# EAGLE design tricoreVCO (EAGLE 9.6.0)
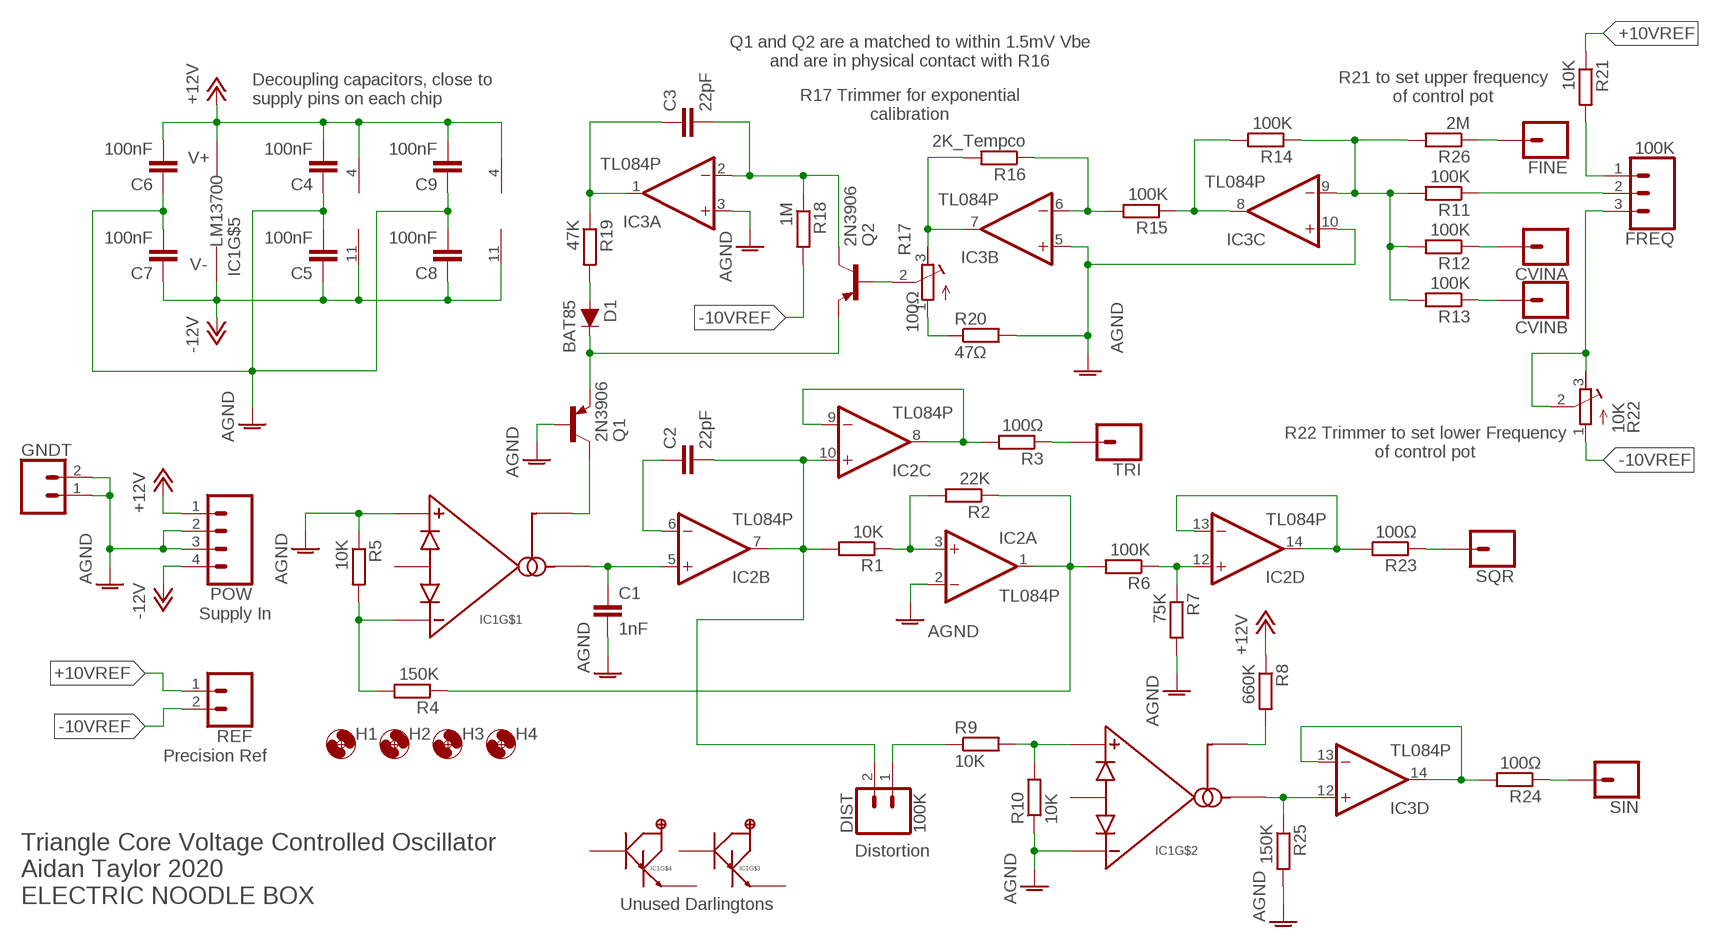
[diagram p0: schematic, sheet 1]

## Parts
C1  1nF  C-EU050-025X075  [C050-025X075]
C2  22pF  C-EU050-025X075  [C050-025X075]
C3  22pF  C-EU050-025X075  [C050-025X075]
C4  100nF  C-EU050-025X075  [C050-025X075]
C5  100nF  C-EU050-025X075  [C050-025X075]
C6  100nF  C-EU050-025X075  [C050-025X075]
C7  100nF  C-EU050-025X075  [C050-025X075]
C8  100nF  C-EU050-025X075  [C050-025X075]
C9  100nF  C-EU050-025X075  [C050-025X075]
CVINA  CONN_01  [1X01]
CVINB  CONN_01  [1X01]
D1  BAT85  DIODE-1N4148  [DIODE-1N4148]
DIST  100K  CONN_02  [1X02]
FINE  CONN_01  [1X01]
FREQ  100K  CONN_03  [1X03]
GNDT  CONN_02  [1X02]
H1  MOUNT-HOLE3.2  [3,2]
H2  MOUNT-HOLE3.2  [3,2]
H3  MOUNT-HOLE3.2  [3,2]
H4  MOUNT-HOLE3.2  [3,2]
IC1  LM13700_DIP  [DIP16]
IC2  TL084P  [DIL14]
IC3  TL084P  [DIL14]
POW  CONN_04POLAR  [MOLEX-1X4]
Q1  2N3906  [TO92]
Q2  2N3906  [TO92]
R1  10K  R-EU_0207/10  [0207/10]
R2  22K  R-EU_0207/10  [0207/10]
R3  100Ω  R-EU_0207/10  [0207/10]
R4  150K  R-EU_0207/10  [0207/10]
R5  10K  R-EU_0207/10  [0207/10]
R6  100K  R-EU_0207/10  [0207/10]
R7  75K  R-EU_0207/10  [0207/10]
R8  660K  R-EU_0207/10  [0207/10]
R9  10K  R-EU_0207/10  [0207/10]
R10  10K  R-EU_0207/10  [0207/10]
R11  100K  R-EU_0207/10  [0207/10]
R12  100K  R-EU_0207/10  [0207/10]
R13  100K  R-EU_0207/10  [0207/10]
R14  100K  R-EU_0207/10  [0207/10]
R15  100K  R-EU_0207/10  [0207/10]
R16  2K_Tempco  R-EU_0207/10  [0207/10]
R17  100Ω  R-TRIMM3296W  [RTRIM3296W]
R18  1M  R-EU_0207/10  [0207/10]
R19  47K  R-EU_0207/10  [0207/10]
R20  47Ω  R-EU_0207/10  [0207/10]
R21  10K  R-EU_0207/10  [0207/10]
R22  10K  R-TRIMM3296W  [RTRIM3296W]
R23  100Ω  R-EU_0207/10  [0207/10]
R24  100Ω  R-EU_0207/10  [0207/10]
R25  150K  R-EU_0207/10  [0207/10]
R26  2M  R-EU_0207/10  [0207/10]
REF  CONN_02POLAR  [MOLEX-1X2]
SIN  CONN_01  [1X01]
SQR  CONN_01  [1X01]
TRI  CONN_01  [1X01]

## Nets
+10VREF: R21.1 REF.1
+12V: C4.2 C6.2 C9.2 IC1.11(V+) IC2.4(P:V+) IC3.4(P:V+) POW.1 R8.1
-10VREF: R18.2 R22.1(A) REF.2
-12V: C5.1 C7.1 C8.1 IC1.6(V-) IC2.11(P:V-) IC3.11(P:V-) POW.4
AGND: C1.2 C4.1 C5.2 C6.1 C7.2 C8.2 C9.1 GNDT.1 GNDT.2 IC1.3(AMP+) IC1.13(AMP-) IC2.2(A:-IN) IC3.3(A:+IN) IC3.5(B:+IN) IC3.10(C:+IN) POW.2 POW.3 Q1.2(B) R5.1 R7.2 R10.1 R20.2 R25.2
N$1: C2.1 IC2.6(B:-IN)
N$2: C2.2 DIST.2 IC2.7(B:OUT) IC2.10(C:+IN) R1.2
N$3: IC2.3(A:+IN) R1.1 R2.2
N$4: C1.1 IC1.5(AMPOUT) IC2.5(B:+IN)
N$5: IC2.1(A:OUT) R2.1 R4.1 R6.2
N$6: IC2.8(C:OUT) IC2.9(C:-IN) R3.2
N$7: IC1.4(AMP-) R4.2 R5.2
N$8: IC1.14(AMP+) R9.2 R10.2
N$9: IC2.12(D:+IN) R6.1 R7.1
N$10: IC1.12(AMPOUT) IC3.12(D:+IN) R25.1
N$11: IC1.16(AMPBIAS) R8.2
N$12: IC1.1(AMPBIAS) Q1.1(C)
N$13: DIST.1 R9.1
N$14: IC3.7(B:OUT) R16.2 R17.3(E)
N$15: IC3.6(B:-IN) R15.2 R16.1
N$16: IC3.8(C:OUT) R14.2 R15.1
N$17: Q2.2(B) R17.2(S)
N$18: C3.2 IC3.2(A:-IN) Q2.1(C) R18.1
N$19: R17.1(A) R20.1
N$20: C3.1 IC3.1(A:OUT) R19.1
N$21: D1.C Q1.3(E) Q2.3(E)
N$22: D1.A R19.2
N$23: IC3.9(C:-IN) R11.2 R12.2 R13.2 R14.1 R26.2
N$24: FREQ.2 R11.1
N$25: FREQ.3 R22.2(S) R22.3(E)
N$26: FREQ.1 R21.2
N$27: CVINA.1 R12.1
N$28: CVINB.1 R13.1
N$29: R3.1 TRI.1
N$30: R23.1 SQR.1
N$31: R24.1 SIN.1
N$32: FINE.1 R26.1
SINE_OUT: IC3.13(D:-IN) IC3.14(D:OUT) R24.2
SQUARE_OUT: IC2.13(D:-IN) IC2.14(D:OUT) R23.2
Unconnected: IC1.2(DIODES) IC1.7(BUFF_IN) IC1.8(BUFF_OUT) IC1.9(BUFF_OUT) IC1.10(BUFF_IN) IC1.15(DIODES)

## Notes on the sheet
- Q1 and Q2 are a matched to within 1.5mV Vbe
  and are in physical contact with R16
- R21 to set upper frequency
  of control pot
- Decoupling capacitors, close to 
  supply pins on each chip
- R17 Trimmer for exponential
  calibration
- R22 Trimmer to set lower Frequency
  of control pot
- Supply In
- Precision Ref
- Distortion
- Triangle Core Voltage Controlled Oscillator
  Aidan Taylor 2020
  ELECTRIC NOODLE BOX
- Unused Darlingtons

## Library data of the parts
C1-C9 = rcl:C-EU: CAPACITOR, European symbol; SPICEPREFIX: C
CVINA CVINB FINE SIN SQR TRI = SparkFun-Connectors:CONN_01: Single connection point. Often used as Generic Header-pin footprint for 0.1 inch spaced/style header connections On any of the 0.1 inch spaced packages, you can populate with these: Break Away Headers - Straight <https://www.sparkfun.com/products/116> (PRT-00116) Break Away Male Headers - Right Angle <https://www.sparkfun.com/products/553> (PRT-00553) Female Headers <https://www.sparkfun.com/products/115> (PRT-00115) Break Away Headers - Machine Pin <https://www.sparkfun.com/products/117> (PRT-00117) Break Away Female Headers - Swiss Machine Pin <https://www.sparkfun.com/products/743> (PRT-00743) This device is also useful as a general connection point to wire up your design to another part of your project. Our various solder wires solder well into these plated through hole pads. Hook-Up Wire - Assortment (Stranded, 22 AWG) <https://www.sparkfun.com/products/11375> (PRT-11375) Hook-Up Wire - Assortment (Solid Core, 22 AWG) <https://www.sparkfun.com/products/11367> (PRT-11367) View the entire wire category on our website here <https://www.sparkfun.com/categories/141> Special notes: SMTSO-256-ET is a "flush mount" nut for a 4-40 screw. We mostly use this on specialty testbeds; it is a nice way to connect hardware to your PCB at an adjustable hieght. Also note, the SNAP packages are for using a snappable style connector. We sell a baggie of snaps and they are also used on two LilyPad designs: Snap Assortment - 30 pack (male and female) <https://www.sparkfun.com/products/11347> (DEV-11347) LilyPad Arduino SimpleSnap <https://www.sparkfun.com/products/10941> (DEV-10941) LilyPad SimpleSnap Protoboard <https://www.sparkfun.com/products/10940> (DEV-10940)
D1 = SparkFun-DiscreteSemi:DIODE: Diode These are standard reverse protection diodes and small signal diodes. SparkFun Products: SparkFun SparkPunk Sound Kit <https://www.sparkfun.com/products/11177> SparkFun ESP8266 Thing <https://www.sparkfun.com/products/13231>; PROD_ID: DIO-08378; VALUE: 200mA/100V/1V
DIST GNDT = SparkFun-Connectors:CONN_02: Multi connection point. Often used as Generic Header-pin footprint for 0.1 inch spaced/style header connections On any of the 0.1 inch spaced packages, you can populate with these: Break Away Headers - Straight <https://www.sparkfun.com/products/116> (PRT-00116) Break Away Male Headers - Right Angle <https://www.sparkfun.com/products/553> (PRT-00553) Female Headers <https://www.sparkfun.com/products/115> (PRT-00115) Break Away Headers - Machine Pin <https://www.sparkfun.com/products/117> (PRT-00117) Break Away Female Headers - Swiss Machine Pin <https://www.sparkfun.com/products/743> (PRT-00743) For SCREWTERMINALS and SPRING TERMINALS visit here: Screw Terimnals on SparkFun.com <https://www.sparkfun.com/search/results?term=Screw+Terminals> (5mm/3.5mm/2.54mm spacing) This device is also useful as a general connection point to wire up your design to another part of your project. Our various solder wires solder well into these plated through hole pads. Hook-Up Wire - Assortment (Stranded, 22 AWG) <https://www.sparkfun.com/products/11375> (PRT-11375) Hook-Up Wire - Assortment (Solid Core, 22 AWG) <https://www.sparkfun.com/products/11367> (PRT-11367) View the entire wire category on our website here <https://www.sparkfun.com/categories/141> Special notes: Molex polarized connector foot print use with: PRT-08233 with associated crimp pins and housings. 2.54_SCREWTERM for use with PRT-10571. 3.5mm Screw Terminal footprints for PRT-08084 5mm Screw Terminal footprints for use with PRT-08432
FREQ = SparkFun-Connectors:CONN_03: Multi connection point. Often used as Generic Header-pin footprint for 0.1 inch spaced/style header connections On any of the 0.1 inch spaced packages, you can populate with these: Break Away Headers - Straight <https://www.sparkfun.com/products/116> (PRT-00116) Break Away Male Headers - Right Angle <https://www.sparkfun.com/products/553> (PRT-00553) Female Headers <https://www.sparkfun.com/products/115> (PRT-00115) Break Away Headers - Machine Pin <https://www.sparkfun.com/products/117> (PRT-00117) Break Away Female Headers - Swiss Machine Pin <https://www.sparkfun.com/products/743> (PRT-00743) Stackable Header - 3 Pin (Female, 0.1") <https://www.sparkfun.com/products/13875> (PRT-13875) For SCREWTERMINALS and SPRING TERMINALS visit here: Screw Terimnals on SparkFun.com <https://www.sparkfun.com/search/results?term=Screw+Terminals> (5mm/3.5mm/2.54mm spacing) This device is also useful as a general connection point to wire up your design to another part of your project. Our various solder wires solder well into these plated through hole pads. Hook-Up Wire - Assortment (Stranded, 22 AWG) <https://www.sparkfun.com/products/11375> (PRT-11375) Hook-Up Wire - Assortment (Solid Core, 22 AWG) <https://www.sparkfun.com/products/11367> (PRT-11367) View the entire wire category on our website here <https://www.sparkfun.com/categories/141> Special notes: Molex polarized connector foot print use with SKU : PRT-08232 with associated crimp pins and housings.; PROD_ID: XXX-00000; VALUE: 455-1750-1-ND
H1-H4 = holes:MOUNT-HOLE: MOUNTING HOLE with drill center marker
IC1 = ElectricNoodleBox2018:LM13700_DIP
IC2 IC3 = linear:TL084: OP AMP
POW = SparkFun-Connectors:CONN_04: Multi connection point. Often used as Generic Header-pin footprint for 0.1 inch spaced/style header connections On any of the 0.1 inch spaced packages, you can populate with these: Break Away Headers - Straight <https://www.sparkfun.com/products/116> (PRT-00116) Break Away Male Headers - Right Angle <https://www.sparkfun.com/products/553> (PRT-00553) Female Headers <https://www.sparkfun.com/products/115> (PRT-00115) Break Away Headers - Machine Pin <https://www.sparkfun.com/products/117> (PRT-00117) Break Away Female Headers - Swiss Machine Pin <https://www.sparkfun.com/products/743> (PRT-00743) For SCREWTERMINALS and SPRING TERMINALS visit here: Screw Terimnals on SparkFun.com <https://www.sparkfun.com/search/results?term=Screw+Terminals> (5mm/3.5mm/2.54mm spacing) This device is also useful as a general connection point to wire up your design to another part of your project. Our various solder wires solder well into these plated through hole pads. Hook-Up Wire - Assortment (Stranded, 22 AWG) <https://www.sparkfun.com/products/11375> (PRT-11375) Hook-Up Wire - Assortment (Solid Core, 22 AWG) <https://www.sparkfun.com/products/11367> (PRT-11367) View the entire wire category on our website here <https://www.sparkfun.com/categories/141> Special notes: Molex polarized connector foot print use with SKU : PRT-08231 with associated crimp pins and housings. 1MM SMD Version SKU: PRT-10208; PROD_ID: CONN-08186; SF_ID: PRT-08231
Q1 Q2 = transistor-pnp:2N3906: PNP Transistor
R1-R16 R18-R21 R23-R26 = rcl:R-EU_: RESISTOR, European symbol; SPICEPREFIX: R
R17 R22 = rcl:R-TRIMM: Trimm resistor; SPICEMODEL: X; SPICEPREFIXL: POT
REF = SparkFun-Connectors:CONN_02: Multi connection point. Often used as Generic Header-pin footprint for 0.1 inch spaced/style header connections On any of the 0.1 inch spaced packages, you can populate with these: Break Away Headers - Straight <https://www.sparkfun.com/products/116> (PRT-00116) Break Away Male Headers - Right Angle <https://www.sparkfun.com/products/553> (PRT-00553) Female Headers <https://www.sparkfun.com/products/115> (PRT-00115) Break Away Headers - Machine Pin <https://www.sparkfun.com/products/117> (PRT-00117) Break Away Female Headers - Swiss Machine Pin <https://www.sparkfun.com/products/743> (PRT-00743) For SCREWTERMINALS and SPRING TERMINALS visit here: Screw Terimnals on SparkFun.com <https://www.sparkfun.com/search/results?term=Screw+Terminals> (5mm/3.5mm/2.54mm spacing) This device is also useful as a general connection point to wire up your design to another part of your project. Our various solder wires solder well into these plated through hole pads. Hook-Up Wire - Assortment (Stranded, 22 AWG) <https://www.sparkfun.com/products/11375> (PRT-11375) Hook-Up Wire - Assortment (Solid Core, 22 AWG) <https://www.sparkfun.com/products/11367> (PRT-11367) View the entire wire category on our website here <https://www.sparkfun.com/categories/141> Special notes: Molex polarized connector foot print use with: PRT-08233 with associated crimp pins and housings. 2.54_SCREWTERM for use with PRT-10571. 3.5mm Screw Terminal footprints for PRT-08084 5mm Screw Terminal footprints for use with PRT-08432; SF_ID: PRT-09918

## Board
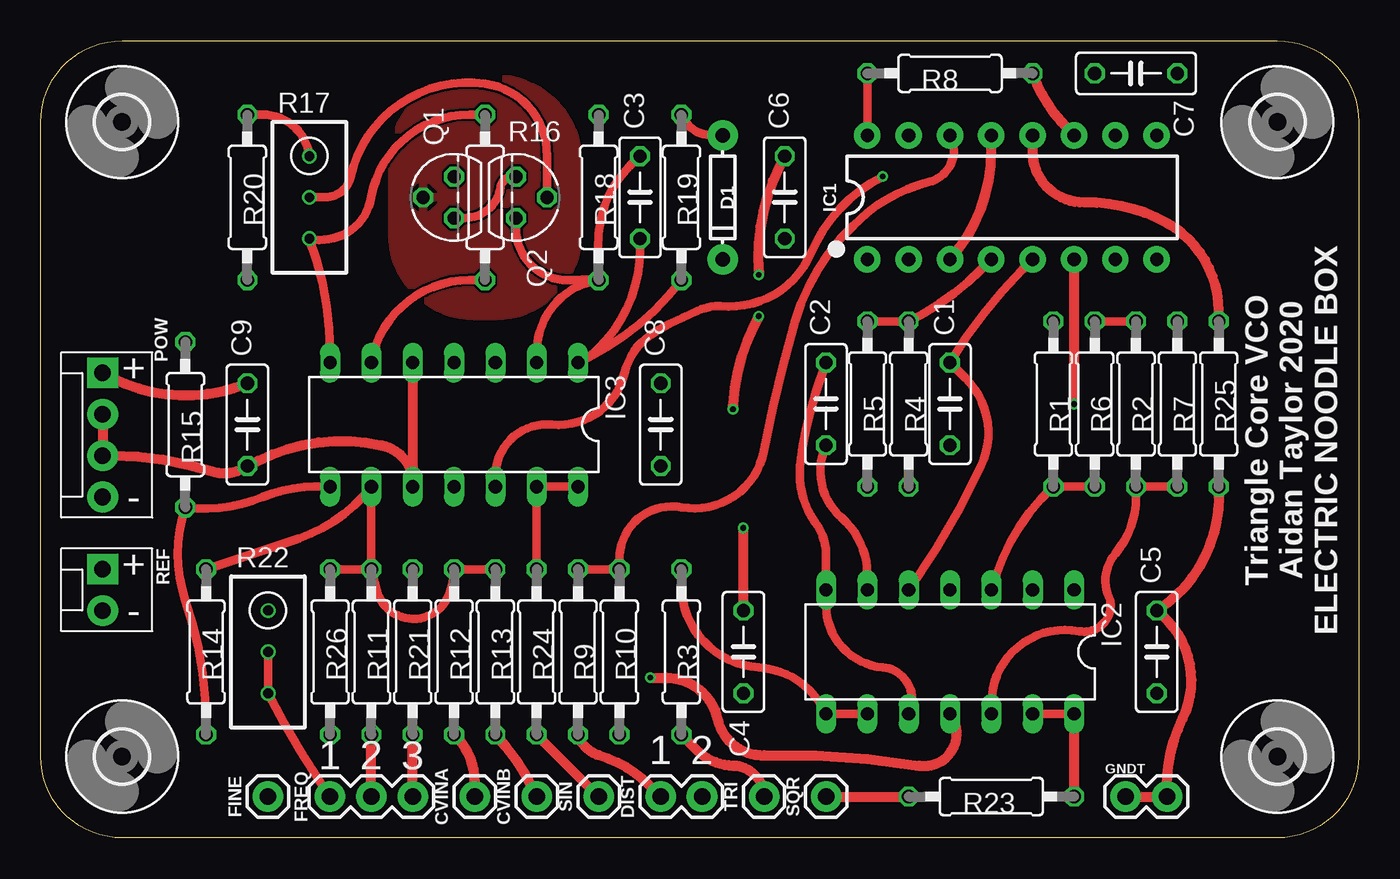
[diagram p1: board, top side]
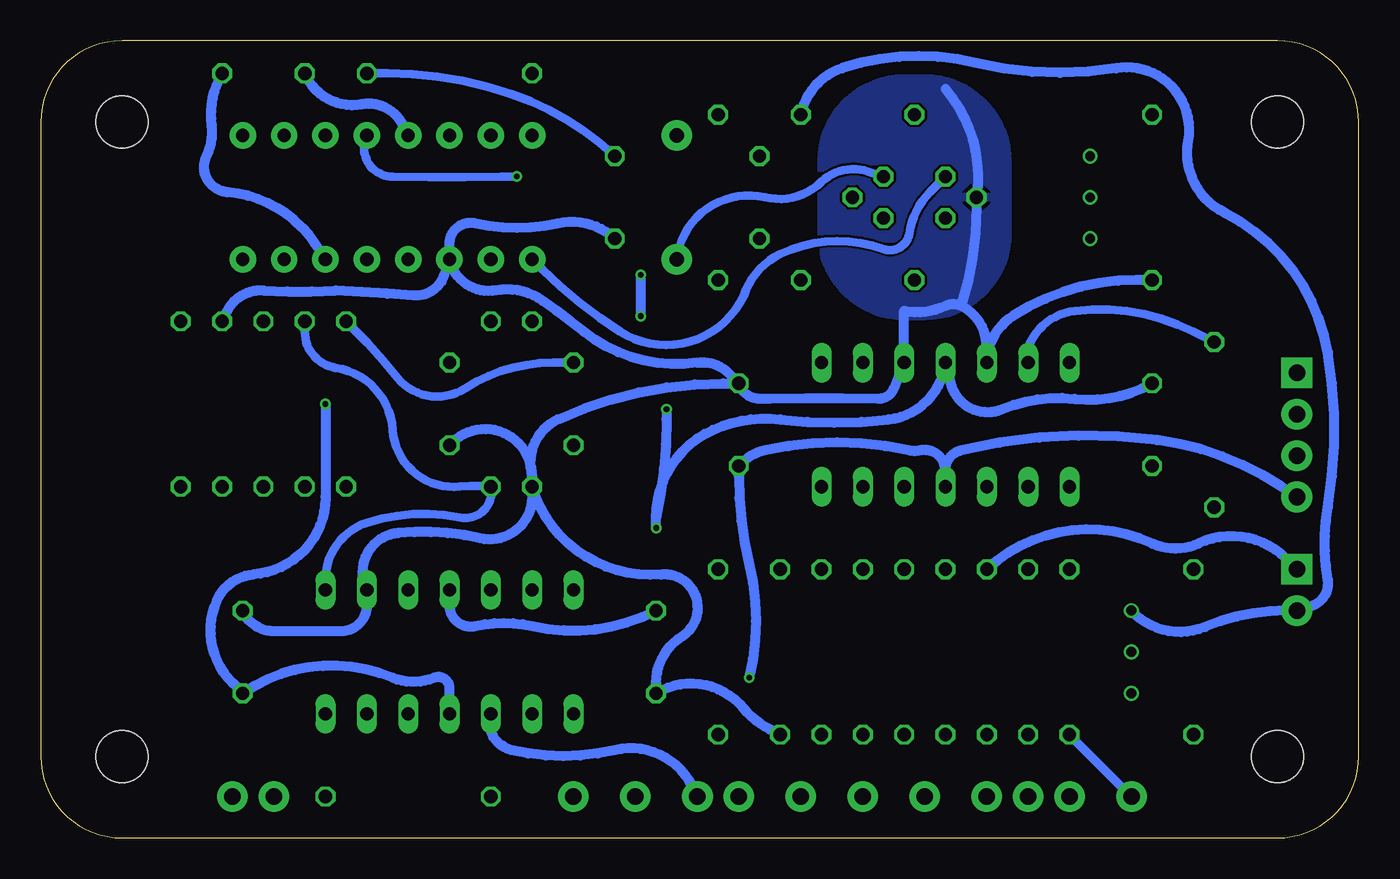
[diagram p2: board, bottom side, seen from below]

Size 81 x 49 mm. Coordinates in mm from the lower left corner, seen from the top.
Outline: 5,49 76,49 arc-90 81,44 81,5 arc-90 76,0 5,0 arc-90 0,5 0,44 arc-90 5,49
Copper layers (1*16): Top 0.035mm / dielectric 1.6mm / Bottom 0.035mm
Design rules "Elecrow_2-layer_PCB_eagle_rule": minimum track width 6mil, minimum drill 12mil, track to track 6mil, track to pad 6mil, pad to pad 6mil, via to via 8mil, smd to smd 0mil, copper to edge 20mil, drill to drill 10mil, minimum pad ring 6mil, minimum via ring 6mil, stop-mask expansion 0mil, vias tented up to drill 100mil, thermal gap 10mil

### Footprints (pad centres in the part's own frame; a part is rotated, then mirrored left to right if it is on the bottom)
C050-025X075 = drill 0.813 octagon: 1 -2.54,0; 2 2.54,0
1X01 = drill 1.016 pad 1.88: 1 0,0
DIODE-1N4148 = drill 0.9 pad 1.88: A -3.81,0; C 3.81,0
1X02 = drill 1.016 pad 1.88: 1 0,0; 2 2.54,0
1X03 = drill 1.016 pad 1.88: 1 0,0; 2 2.54,0; 3 5.08,0
3,2 = hole 3.2: 0,0
DIP16 = drill 0.813 pad 1.626: 1 -8.89,-3.81; 2 -6.35,-3.81; 3 -3.81,-3.81; 4 -1.27,-3.81; 5 1.27,-3.81; 6 3.81,-3.81; 7 6.35,-3.81; 8 8.89,-3.81; 9 8.89,3.81; 10 6.35,3.81; 11 3.81,3.81; 12 1.27,3.81; 13 -1.27,3.81; 14 -3.81,3.81; 15 -6.35,3.81; 16 -8.89,3.81
DIL14 = drill 0.813 long: 1 -7.62,-3.81; 2 -5.08,-3.81; 3 -2.54,-3.81; 4 0,-3.81; 5 2.54,-3.81; 6 5.08,-3.81; 7 7.62,-3.81; 8 7.62,3.81; 9 5.08,3.81; 10 2.54,3.81; 11 0,3.81; 12 -2.54,3.81; 13 -5.08,3.81; 14 -7.62,3.81
MOLEX-1X4 = drill 1.016 pad 1.88 square: 1 0,0 | drill 1.016 pad 1.88: 2 2.54,0; 3 5.08,0; 4 7.62,0
TO92 = drill 0.813 octagon: 1 1.27,0; 2 0,1.905; 3 -1.27,0
0207/10 = drill 0.813 octagon: 1 -5.08,0; 2 5.08,0
RTRIM3296W = drill 0.61: 1 0,-2.54; 2 0,0; 3 0,2.54
MOLEX-1X2 = drill 1.016 pad 1.88 square: 1 0,0 | drill 1.016 pad 1.88: 2 2.54,0

### Placement (x,y rotation side)
C1  55.88,26.67 270 top
C2  48.26,26.67 90 top
C3  36.83,39.37 90 top
C4  43.18,11.43 90 top
C5  68.58,11.43 90 top
C6  45.72,39.37 90 top
C7  67.31,46.99 180 top
C8  38.1,25.4 90 top
C9  12.7,25.4 90 top
CVINA  26.67,2.54 0 top
CVINB  30.48,2.54 0 top
D1  41.91,39.37 270 top
DIST  38.1,2.54 0 top
FINE  13.97,2.54 0 top
FREQ  22.86,2.54 180 top
GNDT  66.67,2.54 0 top
H1  76,44 0 top
H2  76,5 0 top
H3  5,5 0 top
H4  5,44 0 top
IC1  59.69,39.37 0 top
IC2  55.88,11.43 180 top
IC3  25.4,25.4 180 top
POW  3.81,28.57 270 top
Q1  25.4,39.37 90 top
Q2  29.21,39.37 270 top
R1  62.23,26.67 90 top
R2  64.77,26.67 270 top
R3  39.37,11.43 90 top
R4  53.34,26.67 90 top
R5  50.8,26.67 90 top
R6  67.31,26.67 90 top
R7  69.85,26.67 90 top
R8  55.88,46.99 180 top
R9  33.02,11.43 90 top
R10  35.56,11.43 90 top
R11  20.32,11.43 90 top
R12  25.4,11.43 90 top
R13  27.94,11.43 90 top
R14  10.16,11.43 270 top
R15  8.89,25.4 90 top
R16  27.3,39.37 90 top
R17  16.51,39.37 180 top
R18  34.29,39.37 90 top
R19  39.37,39.37 90 top
R20  12.7,39.37 270 top
R21  22.86,11.43 270 top
R22  13.97,11.43 180 top
R23  58.42,2.54 0 top
R24  30.48,11.43 90 top
R25  72.39,26.67 270 top
R26  17.78,11.43 90 top
REF  3.81,16.51 270 top
SIN  34.29,2.54 0 top
SQR  48.26,2.54 0 top
TRI  44.45,2.54 0 top

### Tracks (layer width: path | path; a pad name or v marks a point on that pad's centre or on a via)
+10VREF
  Bottom 0.61: REF.1 4.45,17.14 arc-70 9.84,18.1 arc50 12.7,18.1 arc-68 R21.1
+12V  (via drill 0.35)
  Top 0.61: C4.2 v43.18,19.05 | C6.2 45.4,41.27 arc32 v44.13,34.61 | v44.13,32.07 43.81,31.43 arc23 42.55,26.67 arc7 v42.55,26.35 | IC1.11 63.18,43.5 arc-25 R8.1 | POW.1 4.45,28.26 arc49 C9.2
  Bottom 0.508: R8.1 59.69,46.99 arc19 52.07,45.72 arc24 C6.2
  Bottom 0.61: IC2.4 55.88,14.29 arc-103 54.29,13.02 arc25 50.8,13.02 arc-40 C4.2 | v43.18,19.05 43.18,19.68 | 43.18,19.68 arc66 39.69,25.08 arc31 35.56,25.72 arc-13 28.89,25.72 arc-77 IC3.4 25.08,27.94 arc-99 21.91,26.35 arc29 17.46,26.99 arc-36 C9.2 | v44.13,34.61 v44.13,32.07 | v42.55,26.35 42.55,25.72 arc12 43.18,19.68
-10VREF
  Bottom 0.61: R22.1 arc-70 9.46,12.97 arc23 4.45,13.97 REF.2 2.86,14.29 arc-81 1.91,15.88 arc19 1.91,20.32 arc-19 1.91,29.84 arc-54 8.26,38.42 arc74 10.48,42.86 arc-66 12.06,46.67 arc-44 14.92,47.31 arc23 23.5,47.62 arc-32 31.75,47.31 arc-61 R18.2
-12V  (via drill 0.35)
  Top 0.61: v37.47,9.84 38.42,9.84 arc-77 41.59,7.3 arc79 44.45,5.08 arc-11 53.98,4.45 arc136 IC2.11 | IC1.6 v63.5,26.67
  Bottom 0.61: IC2.11 55.88,9.21 arc-113 56.83,9.84 arc45 59.37,9.84 arc-57 C5.1 69.22,9.53 arc69 70.17,14.61 arc61 67.94,16.19 arc-86 63.5,20.95 v63.5,26.67 | IC3.11 25.4,22.23 | 25.4,22.23 25.4,22.54 arc-103 26.99,23.81 arc25 27.62,23.81 arc-25 36.51,23.81 arc-37 C8.1 38.1,22.23 arc-13 37.47,16.83 arc27 v37.47,9.84 | POW.4 4.76,21.59 arc-26 12.38,24.45 arc-21 24.45,23.81 arc-91 25.4,22.23 | IC1.6 64.14,36.51 arc-52 69.53,39.69 arc111 70.8,41.91 arc-33 70.48,43.81 arc37 C7.1
AGND
  Top 0.61: IC1.3 arc42 58.42,42.23 IC1.13 | IC3.5 22.86,22.23 | 22.86,22.23 IC3.10 | 22.86,22.23 arc65 20.95,24.13 arc39 13.34,23.18 C9.1 arc-52 10.48,22.54 arc18 4.45,23.5 POW.3 POW.2 | R25.2 72.39,20.95 arc-57 C5.2 arc-79 70.17,7.3 arc26 69.22,3.17 GNDT.2 GNDT.1
  Bottom 0.61: C5.2 arc-67 66.67,12.7 62.55,12.7 arc-90 60.96,14.29 IC2.2 arc112 59.05,18.73 arc18 53.98,18.41 arc-103 50.8,20.95 R5.1 | R5.1 50.8,22.23 | 50.8,22.23 arc-139 C1.2 | R5.1 arc-78 42.86,16.19 arc153 41.59,12.38 arc-58 43.18,9.53 C4.1 arc81 37.78,7.94 arc-24 36.2,6.67 R10.1 | IC1.3 55.88,36.51 arc103 54.29,37.78 arc-25 49.21,37.78 arc56 C6.1 | 50.8,22.23 arc82 49.21,25.72 arc25 39.05,27.94 C8.2 | 24.45,32.7 arc64 22.86,30.16 IC3.5 arc57 21.27,32.07 arc33 13.65,34.29 R20.2 | IC1.3 arc-87 53.02,33.66 arc45 50.16,33.02 arc4 47.62,31.11 arc-47 40.64,29.21 arc53 38.73,28.57 C8.2 | 25.4,46.04 arc49 Q1.2 23.5,38.73 arc18 24.45,32.7 | 24.45,32.7 arc-52 25.4,32.7 arc38 27.94,32.38 IC3.3 28.57,27.62 arc69 29.53,26.99 arc-2 36.2,26.99 arc2 36.83,26.99 arc72 C8.2 | IC1.13 58.74,43.81 arc-74 61.28,45.09 arc78 C7.2 | IC1.3 56.2,34.61 arc76 58.1,33.34 arc-1 62.87,33.66 arc8 67.31,33.66 arc-67 69.53,32.38 R7.2
  pour Top: 27.94,32.07 26.67,32.07 arc-90 21.59,37.15 21.59,41.59 arc-90 26.67,46.67 27.94,46.67 arc-90 33.02,41.59 33.02,37.15 arc-90
  pour Bottom: 33.02,41.59 33.02,37.15 arc-90 27.94,32.07 26.67,32.07 arc-90 21.59,37.15 21.59,41.59 arc-90 26.67,46.67 27.94,46.67 arc-90
N$1
  Top 0.508: IC2.6 50.8,16.19 arc49 49.21,19.68 arc-74 C2.1
N$2
  Top 0.508: C2.2 47.62,27.3 arc13 46.67,22.86 arc42 47.62,19.37 arc-36 48.26,17.46 arc-1 IC2.7 48.26,14.29 arc85 51.75,10.48 arc-112 IC2.10
  Bottom 0.508: C2.2 49.53,29.21 arc-33 54.93,27.62 arc83 59.05,28.26 arc-6 61.91,31.43 R1.2
  Bottom 0.61: DIST.2 40.96,3.17 arc-77 45.72,5.4 arc27 52.07,5.4 arc94 IC2.10
N$3
  Top 0.508: IC2.3 58.74,16.19 arc-29 R1.1 R2.2
N$4
  Top 0.508: IC1.5 60.33,34.92 arc14 C1.1 56.83,28.26 arc-70 57.78,22.86 arc-11 IC2.5
N$5
  Top 0.508: R2.1 R6.2
  Bottom 0.508: IC2.1 63.5,15.88 arc72 60.96,19.37 arc30 55.24,19.68 arc-113 R4.1 arc-11 55.24,21.59 arc92 59.37,25.08 arc-77 62.87,28.89 arc81 64.77,31.11 R2.1
N$6
  Top 0.508: IC2.9 IC2.8 arc62 44.13,10.48 arc-86 39.37,15.56 R3.2
N$7
  Top 0.508: R5.2 R4.2 arc19 57.78,34.92 IC1.4
N$8
  Top 0.508: R9.2 R10.2 35.56,17.14 arc-100 39.37,20.32 arc90 44.45,23.81 arc-6 46.35,31.75 arc-35 50.8,38.42 arc-25 54.61,40.32 arc104 IC1.14
N$9
  Top 0.508: IC2.12 58.42,8.26 arc-101 63.82,12.7 arc112 65.72,14.61 arc-67 66.04,17.46 arc40 67.31,20.95 R6.1 R7.1
N$10  (via drill 0.35)
  Top 0.508: IC3.12 27.94,22.23 arc-95 31.43,25.4 arc82 35.88,28.57 arc-47 37.78,31.11 arc-6 40.32,32.38 arc-22 41.77,32.7 arc74 47.34,35.95 arc-41 51.75,40.64 arc221 v51.74,40.65
  Top 0.61: R25.1 72.39,32.38 arc61 69.22,37.78 arc30 64.14,39.05 arc-92 60.96,42.23 arc2 IC1.12
  Bottom 0.508: v51.74,40.65 52.7,40.64 arc1 59.37,40.64 arc115 IC1.12
N$11
  Top 0.508: R8.2 IC1.16
N$12
  Bottom 0.508: Q1.1 26.35,39.69 arc-37 27.62,37.15 arc102 29.21,36.2 arc-46 35.56,35.88 arc-46 37.78,33.34 arc97 45.4,31.11 arc13 50.16,34.92 IC1.1
N$13
  Top 0.61: DIST.1 37.47,3.17 arc28 34.29,5.08 arc-56 R9.1
N$14
  Top 0.508: IC3.7 17.78,29.84 arc21 R17.3 arc93 20.32,39.37 arc-80 26.35,44.45 R16.2
N$15
  Top 0.508: R16.1 26.35,34.29 arc80 IC3.6
  Bottom 0.508: R15.2 10.16,31.11 arc-33 17.46,32.38 arc-50 20,30.8 arc-43 IC3.6
N$16
  Top 0.508: R14.2 10.16,6.99 arc19 8.89,14.61 arc-38 R15.1 arc30 13.65,20.95 arc-23 16.83,21.59 IC3.8
N$17
  Top 0.508: R17.2 17.46,39.37 arc77 19.05,40.64 arc-85 27.3,46.35 arc-83 31.11,41.91 arc2 Q2.2
N$18
  Top 0.508: Q2.1 29.21,37.47 arc95 32.7,34.29 arc-11 R18.1 | IC3.2 30.48,29.84 arc-81 R18.1 | C3.2 36.2,41.27 arc40 34.29,37.15 arc9 R18.1
N$19
  Top 0.508: R20.1 13.65,44.45 arc-83 R17.1
N$20
  Top 0.508: IC3.1 33.66,29.53 | 33.66,29.53 arc26 R19.1 | C3.1 36.83,36.2 arc-51 33.66,29.53
N$21
  Top 0.508: Q1.3 26.04,38.1 arc81 28.26,40.01 arc-95 Q2.3
  Bottom 0.508: Q2.3 30.16,40.96 arc-62 33.02,40.32 arc56 36.51,39.37 arc-96 D1.C
N$22
  Top 0.508: D1.A 41.27,43.18 arc-67 R19.2
N$23
  Top 0.508: R11.2 IC3.9 arc-34 15.88,18.41 R14.1 | R13.2 R12.2 arc-22 25.08,14.92 arc-144 20.64,15.24 R11.2 | R26.2 R11.2
N$24
  Top 0.61: FREQ.2 R11.1
N$25
  Top 0.508: R22.2 R22.3 arc6 17.14,3.49 FREQ.3
N$26
  Top 0.61: FREQ.1 R21.2
N$27
  Top 0.61: CVINA.1 26.67,3.49 arc48 R12.1
N$28
  Top 0.61: CVINB.1 30.16,3.17 arc17 R13.1
N$29
  Top 0.61: R3.1 40.32,5.4 arc44 42.55,4.45 arc-87 TRI.1
N$30
  Top 0.61: SQR.1 R23.1
N$31
  Top 0.61: SIN.1 R24.1
N$32
  Bottom 0.508: FINE.1 R26.1
SINE_OUT
  Top 0.508: R24.2 IC3.13 IC3.14
SQUARE_OUT
  Top 0.508: IC2.14 IC2.13
  Top 0.61: IC2.14 R23.2

### Text on the board
tPlace: + | Triangle Core VCO / Aidan Taylor 2020 / ELECTRIC NOODLE BOX | - | + | - | 1 | 2 | 3 | 1 | 2